# EAGLE design placa (EAGLE 6.4)
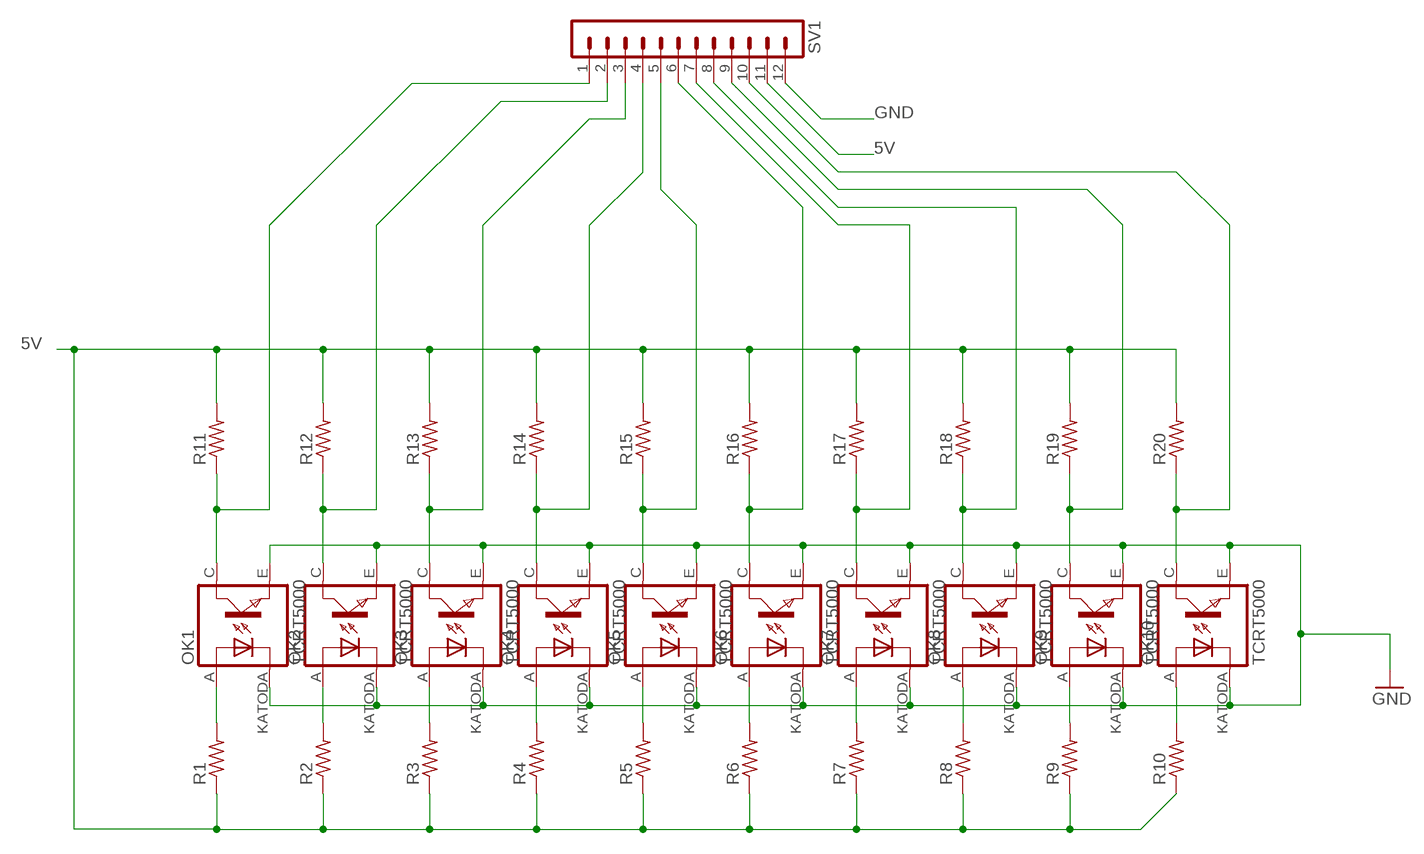
[diagram p0: schematic, sheet 1]

## Parts
OK1  TCRT5000  [TCRT5000]
OK2  TCRT5000  [TCRT5000]
OK3  TCRT5000  [TCRT5000]
OK4  TCRT5000  [TCRT5000]
OK5  TCRT5000  [TCRT5000]
OK6  TCRT5000  [TCRT5000]
OK7  TCRT5000  [TCRT5000]
OK8  TCRT5000  [TCRT5000]
OK9  TCRT5000  [TCRT5000]
OK10  TCRT5000  [TCRT5000]
R1  R-US_0204/7  [0204/7]
R2  R-US_0204/7  [0204/7]
R3  R-US_0204/7  [0204/7]
R4  R-US_0204/7  [0204/7]
R5  R-US_0204/7  [0204/7]
R6  R-US_0204/7  [0204/7]
R7  R-US_0204/7  [0204/7]
R8  R-US_0204/7  [0204/7]
R9  R-US_0204/7  [0204/7]
R10  R-US_0204/7  [0204/7]
R11  R-US_0204/7  [0204/7]
R12  R-US_0204/7  [0204/7]
R13  R-US_0204/7  [0204/7]
R14  R-US_0204/7  [0204/7]
R15  R-US_0204/7  [0204/7]
R16  R-US_0204/7  [0204/7]
R17  R-US_0204/7  [0204/7]
R18  R-US_0204/7  [0204/7]
R19  R-US_0204/7  [0204/7]
R20  R-US_0204/7  [0204/7]
SV1  MA12-1W  [MA12-1W]

## Nets
5V: R1.1 R2.1 R3.1 R4.1 R5.1 R6.1 R7.1 R8.1 R9.1 R10.1 R11.2 R12.2 R13.2 R14.2 R15.2 R16.2 R17.2 R18.2 R19.2 R20.2 SV1.11
GND: OK1.E(EMITTER) OK1.KATODA(CATHODE) OK2.E(EMITTER) OK2.KATODA(CATHODE) OK3.E(EMITTER) OK3.KATODA(CATHODE) OK4.E(EMITTER) OK4.KATODA(CATHODE) OK5.E(EMITTER) OK5.KATODA(CATHODE) OK6.E(EMITTER) OK6.KATODA(CATHODE) OK7.E(EMITTER) OK7.KATODA(CATHODE) OK8.E(EMITTER) OK8.KATODA(CATHODE) OK9.E(EMITTER) OK9.KATODA(CATHODE) OK10.E(EMITTER) OK10.KATODA(CATHODE) SV1.12
N$1: OK2.A(ANODE) R2.2
N$2: OK1.C(COLLECTOR) R11.1 SV1.1
N$3: OK1.A(ANODE) R1.2
N$4: OK3.A(ANODE) R3.2
N$5: OK4.A(ANODE) R4.2
N$6: OK5.A(ANODE) R5.2
N$7: OK6.A(ANODE) R6.2
N$8: OK7.A(ANODE) R7.2
N$9: OK8.A(ANODE) R8.2
N$11: OK9.A(ANODE) R9.2
N$12: OK10.A(ANODE) R10.2
N$22: OK2.C(COLLECTOR) R12.1 SV1.2
N$23: OK3.C(COLLECTOR) R13.1 SV1.3
N$28: OK8.C(COLLECTOR) R18.1 SV1.8
N$30: OK10.C(COLLECTOR) R20.1 SV1.10
N$33: OK4.C(COLLECTOR) R14.1 SV1.4
N$34: OK5.C(COLLECTOR) R15.1 SV1.5
N$35: OK6.C(COLLECTOR) R16.1 SV1.6
N$36: OK7.C(COLLECTOR) R17.1 SV1.7
N$38: OK9.C(COLLECTOR) R19.1 SV1.9

## Library data of the parts
OK1-OK10 = vishay:TCRT5000
R1-R20 = rcl:R-US_: RESISTOR, American symbol
SV1 = con-lstb:MA12-1W: PIN HEADER; OC_FARNELL: unknown; OC_NEWARK: unknown

## Board
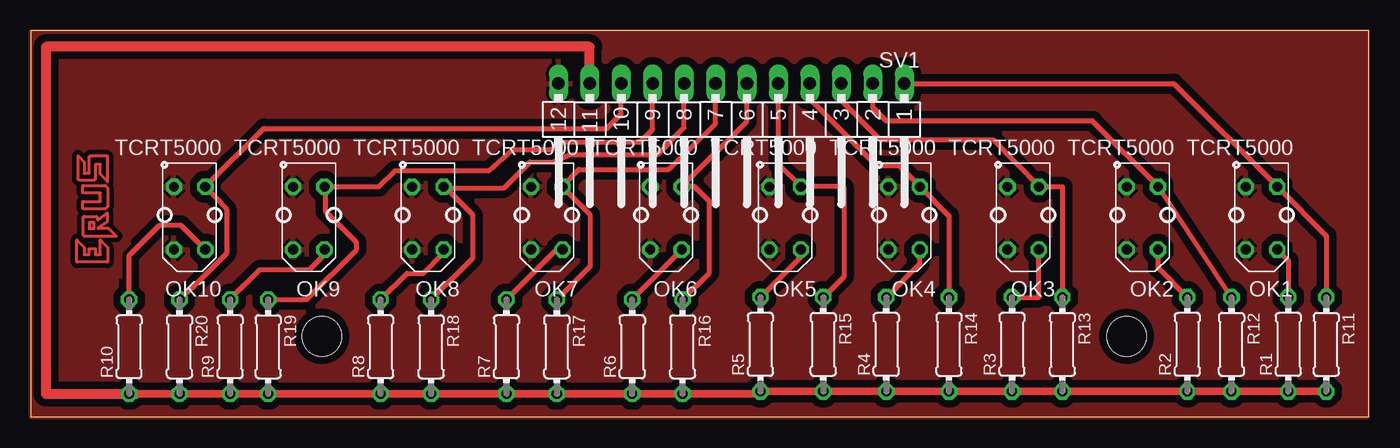
[diagram p1: board, top side]

Size 108.05 x 31.19 mm. Coordinates in mm from the lower left corner, seen from the top.
Outline: 0,0 108.05,0 108.05,31.19 0,31.19 0,0
Copper layers (1*16): Top 0.035mm / dielectric 1.5mm / Bottom 0.035mm
Design rules "default *": minimum track width 10mil, minimum drill 24mil, track to track 8mil, track to pad 8mil, pad to pad 8mil, via to via 8mil, smd to smd 8mil, copper to edge 0mil, drill to drill 8mil, minimum pad ring 10mil, minimum via ring 8mil, stop-mask expansion 4mil, vias tented up to drill 0mil, thermal gap 10mil
Holes 3.2 mm at 23.5,6.5 88.5,6.5

### Footprints (pad centres in the part's own frame; a part is rotated, then mirrored left to right if it is on the bottom)
TCRT5000 = drill 0.8 octagon: A -2.54,-1.27; C 2.54,-1.27; E 2.54,1.27; KATODA -2.54,1.27
0204/7 = drill 0.813 octagon: 1 -3.81,0; 2 3.81,0
MA12-1W = drill 1.016 long: 1 -13.97,0; 2 -11.43,0; 3 -8.89,0; 4 -6.35,0; 5 -3.81,0; 6 -1.27,0; 7 1.27,0; 8 3.81,0; 9 6.35,0; 10 8.89,0; 11 11.43,0; 12 13.97,0

### Placement (x,y rotation side)
OK1  99.4,16.05 90 top
OK2  89.78,16.05 90 top
OK3  80.16,16.05 90 top
OK4  70.54,16.05 90 top
OK5  60.92,16.05 90 top
OK6  51.3,16.05 90 top
OK7  41.68,16.05 90 top
OK8  32.06,16.05 90 top
OK9  22.44,16.05 90 top
OK10  12.82,16.05 90 top
R1  101.57,5.85 90 top
R2  93.41,5.85 90 top
R3  79.25,5.85 90 top
R4  69.09,5.85 90 top
R5  58.93,5.85 90 top
R6  48.57,5.66 90 top
R7  38.41,5.66 90 top
R8  28.25,5.66 90 top
R9  16.09,5.66 90 top
R10  7.93,5.66 90 top
R11  104.64,5.85 270 top
R12  96.98,5.85 270 top
R13  83.32,5.85 270 top
R14  74.16,5.85 270 top
R15  64,5.85 270 top
R16  52.64,5.66 270 top
R17  42.48,5.66 270 top
R18  32.32,5.66 270 top
R19  19.16,5.66 270 top
R20  12,5.66 270 top
SV1  56.57,26.94 180 top

### Tracks (layer width: path | path; a pad name or v marks a point on that pad's centre or on a via)
5V
  Top 0.61: R10.1 8.5,1.85 R20.2 R9.1 R19.2 R8.1 R18.2 R7.1 R17.2 R6.1 R16.2 58.93,1.85 R5.1 R15.2 R4.1 R14.2 R3.1 R13.2 R2.1 R12.2 R1.1 R11.2
  Top 0.813: SV1.11 45.14,29.9 1.2,29.9 1.2,1.85 8.5,1.85
GND
  pour Top (isolate 0.61): 0,0 108,0 108,31.1 0,31.1
N$1
  Top 0.406: R2.2 91.05,12.02 OK2.A
N$2
  Top 0.406: SV1.1 92.32,26.94 OK1.C 104.64,14.62 R11.1
N$3
  Top 0.406: OK1.A 101.57,12.61 R1.2
N$4
  Top 0.406: R3.2 81.43,9.66 OK3.A
N$5
  Top 0.406: R4.2 71.81,12.38 OK4.A
N$6
  Top 0.406: R5.2 62.19,12.92 OK5.A
N$7
  Top 0.406: R6.2 52.57,13.47 OK6.A
N$8
  Top 0.406: R7.2 42.45,13.51 OK7.A
N$9
  Top 0.406: R8.2 30.38,11.6 31.7,11.6 33.33,13.23 OK8.A
N$10
  Top 0.254: 4.3,14.6 6.9,14.6 6.3,15.2 5.4,15.2 6.2,15.8 6.2,16.5 5.4,15.9 5.4,16.1 5.3,16.2 4.3,16.2 4.2,16.1 4.2,14.7 4.3,14.6
N$11
  Top 0.406: R9.2 16.07,9.47 | 16.07,9.47 15.9,9.3 | 16.07,9.47 18.5,11.9 22.5,11.9 23.71,13.11 OK9.A 23.71,13.89
N$12
  Top 0.406: R10.2 7.93,13.03 10.4,15.5 12.1,15.5 OK10.A
N$14
  Top 0.254: 3.7,12.5 3.7,14.3 4.3,13.7 4.3,13.1 4.7,13.1 4.7,13.6 5.2,13.6 5.2,13.1 5.6,13.1 5.6,14.3 6.2,13.7 6.2,12.5 3.7,12.5
N$15
  Top 0.254: 6,16.8 4.2,16.8 4.2,17.4 5.6,17.4 5.6,18.1 4.2,18.1 4.2,18.7 6,18.7 6.2,18.5 6.2,17 6,16.8
N$16
  Top 0.254: 6.2,19 6.2,21 6.1,21.1 4.8,21.1 4.7,21 4.7,19.7 4.3,19.7 4.3,20.6 3.8,21.1 3.8,19.2 3.9,19.1 5.1,19.1 5.2,19.2 5.2,20.4 5.6,20.4 5.6,19.6 6.2,19
N$17
  Top 0.254: 5.1,15.2 5.1,15.7 4.7,15.7 4.7,15.2 5.1,15.2
N$18
  pour Top (isolate 0.35): 3,11.2 arc1 3,21.8 8,21.8 8,11.2
N$22
  Top 0.406: R12.1 OK2.C 85.74,23.9 69.1,23.9 68,25 SV1.2
N$23
  Top 0.406: SV1.3 65.46,25.54 68.6,22.4 77.72,22.4 OK3.C 83.32,18.59 R13.1
N$28
  Top 0.406: R18.1 35.7,12.85 35.7,16.3 33.41,18.59 OK8.C 33.42,18.5 38.2,18.5 40.3,20.6 42.2,20.6 43.5,21.2 50.6,21.2 52.76,23.36 SV1.8
N$30
  Top 0.406: SV1.10 47.68,24.48 46.5,23.3 18.8,23.3 OK10.C 15.8,16.78 15.8,13.2 12.97,10.37 R20.1
N$33
  Top 0.406: SV1.4 62.92,25.68 68.3,20.3 70.1,20.3 OK4.C 74.16,16.24 R14.1
N$34
  Top 0.406: R15.1 65.7,11.36 65.7,18.5 65.61,18.59 OK5.C 60.38,20.4 SV1.5
N$35
  Top 0.406: R16.1 54.8,11.63 54.8,17.4 53.61,18.59 OK6.C 57.84,23.86 SV1.6
N$36
  Top 0.406: SV1.7 55.3,23.7 51.5,20 44.26,20 OK7.C 42.95,18.55 45.2,16.3 45.2,12.19 R17.1
N$38
  Top 0.406: SV1.9 50.22,23.22 49.2,22.2 43.1,22.2 42,21.6 38.9,21.6 37,19.9 29.4,19.9 28.1,18.6 OK9.C 23.8,18.5 23.8,16.6 26.3,14.1 26.3,13.5 22.27,9.47 R19.1